# EAGLE schematic RF_Board (EAGLE 9.5.1)
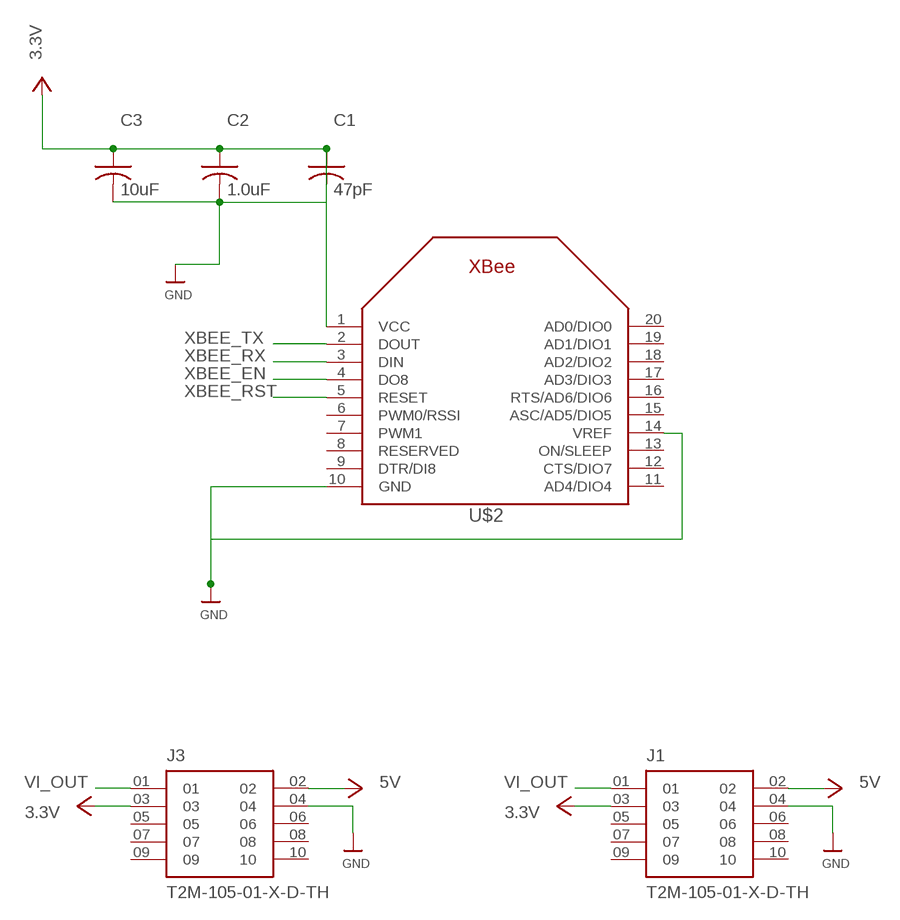
[diagram p0: schematic, sheet 1]

## Parts
C1  47pF  C-US025-024X044  [C025-024X044]
C2  1.0uF  C-US025-024X044  [C025-024X044]
C3  10uF  C-US025-024X044  [C025-024X044]
J1  T2M-105-01-X-D-TH  [SAMTEC_T2M-105-01-X-D-TH]
J3  T2M-105-01-X-D-TH  [SAMTEC_T2M-105-01-X-D-TH]
U$2  XBEE  [XBEE]

## Nets
GND: C1.2 C2.2 C3.2 J1.04 J3.04 U$2.10(GND) U$2.14(VREF)
VCC: C1.1 C2.1 C3.1 J1.02 J1.03 J3.02 J3.03 U$2.1(VCC) ; supply symbol labelled 5V, 3.3V
VI_OUT: J1.01 J3.01
XBEE_EN: U$2.4(DO8)
XBEE_RST: U$2.5(RESET)
XBEE_RX: U$2.3(DIN)
XBEE_TX: U$2.2(DOUT)
Unconnected: J1.05 J1.06 J1.07 J1.08 J1.09 J1.10 J3.05 J3.06 J3.07 J3.08 J3.09 J3.10 U$2.6(PWM0/RSSI) U$2.7(PWM1) U$2.8(RESERVED) U$2.9(DTR/DI8) U$2.11(AD4/DIO4) U$2.12(CTS/DIO7) U$2.13(ON/SLEEP) U$2.15(ASC/AD5/DIO5) U$2.16(RTS/AD6/DIO6) U$2.17(AD3/DIO3) U$2.18(AD2/DIO2) U$2.19(AD1/DIO1) U$2.20(AD0/DIO0)

## Library data of the parts
C1-C3 = adafruit:C-US: CAPACITOR, American symbol
J1 J3 = T2M-105-01-X-D-TH:T2M-105-01-X-D-TH; MANUFACTURER: Samtec; MAXIMUM_PACKAGE_HEIGHT: 6.55mm; PARTREV: AH; STANDARD: Manufacturer Recommendations
U$2 = adafruit:XBEE